# Altium schematic sheet project.SchDoc
size A4
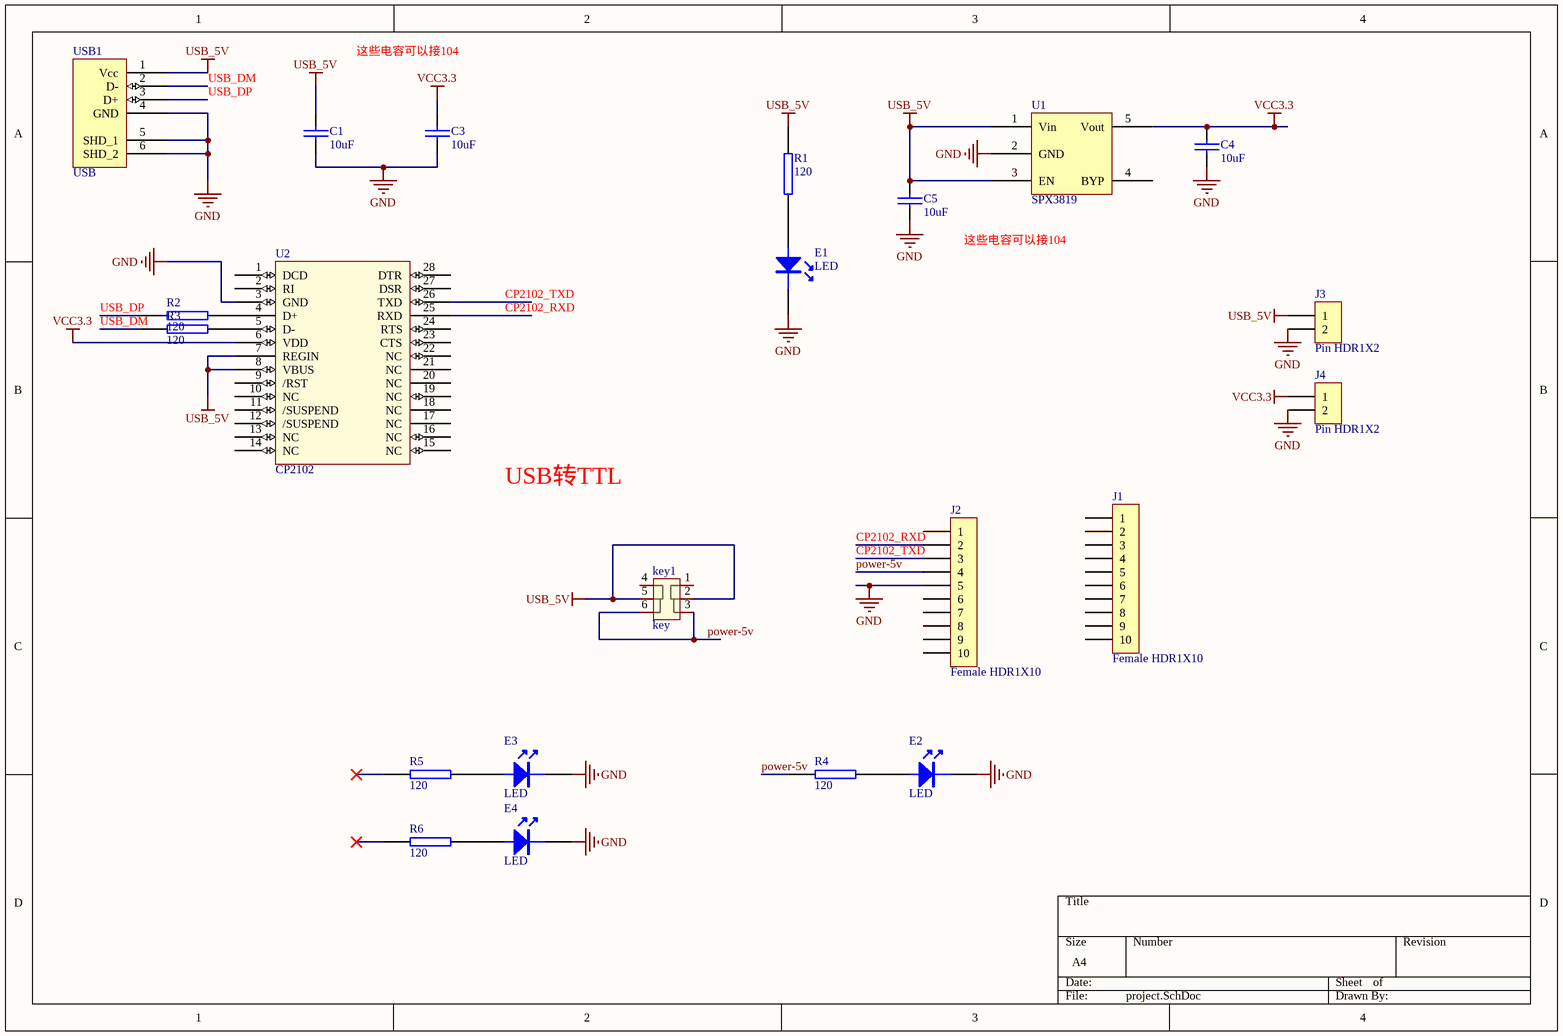
[diagram p0: project.SchDoc]

## Parts
C1  10uF  [0603C]
C3  10uF  [0603C]
C4  10uF  [0603C]
C5  10uF  [0603C]
E1  LED  [LED_0603L]
E2  LED  [LED_0603L]
E3  LED  [LED_0603L]
E4  LED  [LED_0603L]
J1  Female HDR1X10  [Fe-HDR1X10/2.54-S]
J2  Female HDR1X10  [Fe-HDR1X10/2.54-S]
J3  Pin HDR1X2  [Pin HDR1X2/2.54mm-S]
J4  Pin HDR1X2  [Pin HDR1X2/2.54mm-S]
key1  key  [SW_6P_Lock]
R1  120  [0603R]
R2  120  [0603R]
R3  120  [0603R]
R4  120  [0603R]
R5  120  [0603R]
R6  120  [0603R]
U1  SPX3819  [SOT-23-5]
U2  CP2102  [QFN28]
USB1  USB  [USB-TB]

## Nets
GND: C1.2 C3.2 C4.2 C5.2 E1.2 E2.2 E3.2 E4.2 J2.5 J3.2 J4.2 U1.2(GND) U2.3(GND) USB1.4(GND) USB1.5(SHD_1) USB1.6(SHD_2)
USB_5V: C1.1 C5.1 J3.1 key1.2 key1.5 R1.2 U1.1(Vin) U1.3(EN) U2.7(REGIN) U2.8(VBUS) USB1.1(Vcc)
VCC3.3: C3.1 C4.1 J4.1 U1.5(Vout) U2.6(VDD)
CP2102_RXD: J2.2 U2.25(RXD)
CP2102_TXD: J2.3 U2.26(TXD)
power-5v: J2.4 key1.3 key1.6 R4.2
USB_DM: R3.1 USB1.2(D-)
USB_DP: R2.1 USB1.3(D+)
NetE1_1: E1.1 R1.1
NetE2_1: E2.1 R4.1
NetE3_1: E3.1 R5.1
NetE4_1: E4.1 R6.1
NetR2_2: R2.2 U2.4(D+)
NetR3_2: R3.2 U2.5(D-)

Not connected (* = marked no-connect by the designer): J1 1 2 3 4 5 6 7 8 9 10; J2 1 6 7 8 9 10; key1 1 4; R5 2*; R6 2*; U1 4(BYP); U2 1(DCD) 2(RI) 9(/RST) 10(NC) 11(/SUSPEND) 12(/SUSPEND) 13(NC) 14(NC) 15(NC) 16(NC) 17(NC) 18(NC) 19(NC) 20(NC) 21(NC) 22(NC) 23(CTS) 24(RTS) 27(DSR) 28(DTR)

## Notes on the sheet
- 这些电容可以接104
- USB转TTL

## Library data of the parts
C1 C3-C5 = CAP Nonpolarity: 无极电容
E1-E4 = LED: LED灯
key1 = SW_6pin_Lock: 6pin自锁开关
R1-R6 = R: 电阻
U1 = SPX3819: 稳压器
U2 = CP2102: usb转usart